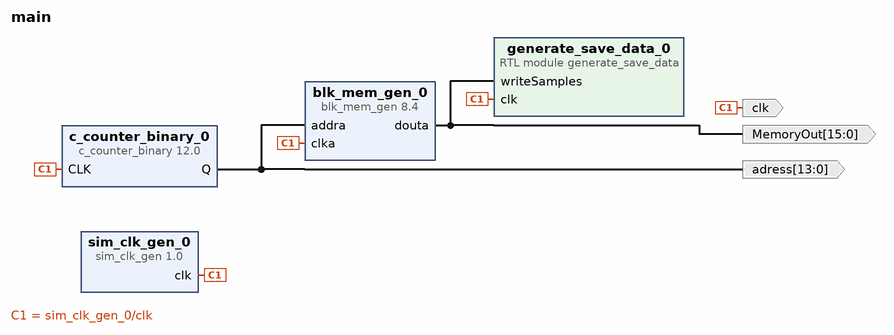
[diagram p0: block diagram of the top level]
# Vivado block design main, xczu48dr-fsvg1517-2-e, Vivado 2020.2
create_bd_design main

create_bd_port -dir O clk
create_bd_port -dir O -from 15 -to 0 MemoryOut
create_bd_port -dir O -from 13 -to 0 adress

create_bd_cell -type ip -vlnv xilinx.com:ip:blk_mem_gen:8.4 blk_mem_gen_0
set_property -dict [list \
  CONFIG.Coe_File ../../../../../../memoryTaps.coe \
  CONFIG.Enable_32bit_Address false \
  CONFIG.Enable_A Always_Enabled \
  CONFIG.Fill_Remaining_Memory_Locations true \
  CONFIG.Load_Init_File true \
  CONFIG.Memory_Type Single_Port_ROM \
  CONFIG.Port_A_Write_Rate 0 \
  CONFIG.Register_PortA_Output_of_Memory_Primitives true \
  CONFIG.Use_RSTA_Pin false \
  CONFIG.Write_Depth_A 16384 \
  CONFIG.Write_Width_A 16 \
  CONFIG.use_bram_block Stand_Alone \
] [get_bd_cells blk_mem_gen_0]
create_bd_cell -type ip -vlnv xilinx.com:ip:sim_clk_gen:1.0 sim_clk_gen_0
create_bd_cell -type ip -vlnv xilinx.com:ip:c_counter_binary:12.0 c_counter_binary_0
set_property -dict {CONFIG.Output_Width 14} [get_bd_cells c_counter_binary_0]
create_bd_cell -type module -reference generate_save_data generate_save_data_0

# ---- connections ----

connect_bd_net [get_bd_pins sim_clk_gen_0/clk] \
  [get_bd_pins blk_mem_gen_0/clka] [get_bd_pins c_counter_binary_0/CLK] [get_bd_ports clk] \
  [get_bd_pins generate_save_data_0/clk]
connect_bd_net [get_bd_pins c_counter_binary_0/Q] [get_bd_pins blk_mem_gen_0/addra] [get_bd_ports adress]
connect_bd_net [get_bd_pins blk_mem_gen_0/douta] [get_bd_ports MemoryOut] [get_bd_pins generate_save_data_0/writeSamples]

validate_bd_design
save_bd_design
